# Altium schematic sheet Uc_Ticketing_Master.SchDoc
size A4; Author: Mario Dos Santos; Organization: ETML-ES; Address1: Avenue Recordon 1; Address2: 1004 Lausanne; Address3: Switzerland; Revision: C; SheetNumber: 3; SheetTotal: 6
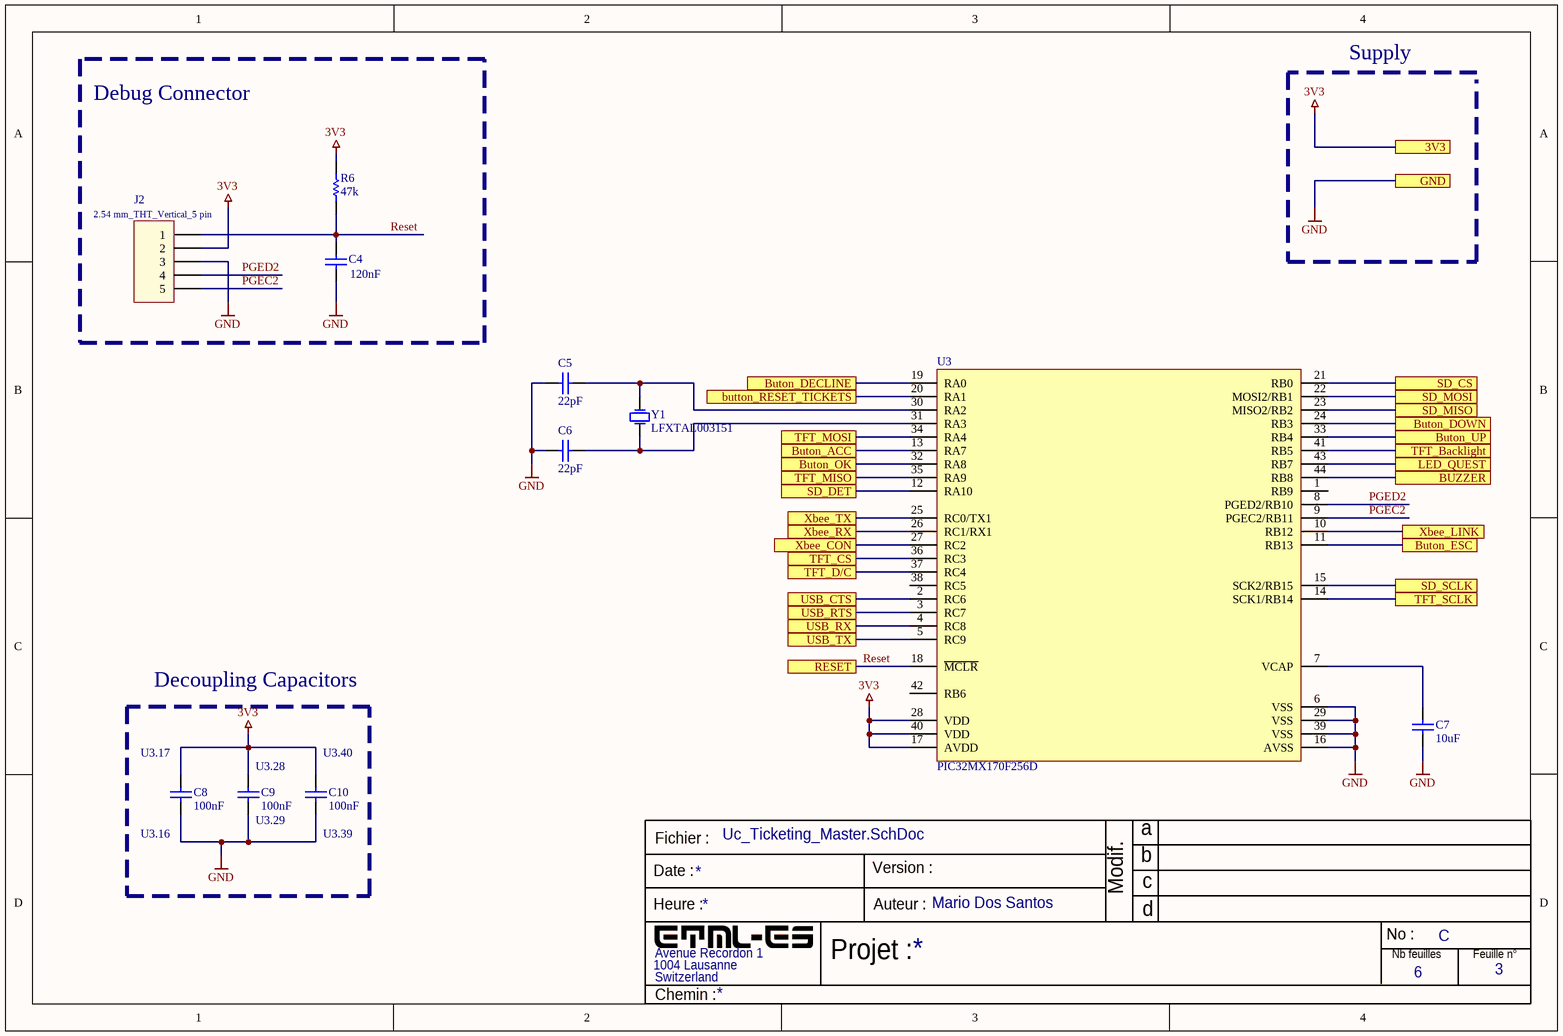
[diagram p0: Uc_Ticketing_Master.SchDoc]

## Parts
C4  120nF  [6-0805_N]
C5  22pF  [6-0805_N]
C6  22pF  [6-0805_N]
C7  10uF  [6-0805_N]
C8  100nF  [6-0805_N]
C9  100nF  [6-0805_N]
C10  100nF  [6-0805_N]
J2  2.54 mm_THT_Vertical_5 pin  [61300511121]
R6  47k  [RESC0805(2012)_L]
U3  PIC32MX170F256D  [MCHP-TQFP-PT44_N]
Y1  LFXTAL003151  [LFXTAL003151REEL]

## Blocks framed on the sheet
Debug Connector: C4 J2 R6
Decoupling Capacitors: C8-C10

## Ports
3V3, Buton_ACC, Buton_DECLINE, Buton_DOWN, Buton_ESC, Buton_OK, Buton_UP, button_RESET_TICKETS, BUZZER, GND, LED_QUEST, RESET, SD_CS, SD_DET, SD_MISO, SD_MOSI, SD_SCLK, TFT_Backlight, TFT_CS, TFT_D/C, TFT_MISO, TFT_MOSI, TFT_SCLK, USB_CTS, USB_RTS, USB_RX, USB_TX, Xbee_CON, Xbee_LINK, Xbee_RX, Xbee_TX

## Nets
3V3: C8.2 C9.2 C10.2 J2.2 R6.1 U3.17(AVDD) U3.28(VDD) U3.40(VDD) ; port 3V3
GND: C4.1 C5.1 C6.1 C7.1 C8.1 C9.1 C10.1 J2.3 U3.6(VSS) U3.16(AVSS) U3.29(VSS) U3.39(VSS) ; port GND
Buton_ACC: U3.13(RA7) ; port Buton_ACC
Buton_DECLINE: U3.19(RA0) ; port Buton_DECLINE
Buton_DOWN: U3.24(RB3) ; port Buton_DOWN
Buton_ESC: U3.11(RB13) ; port Buton_ESC
Buton_OK: U3.32(RA8) ; port Buton_OK
Buton_UP: U3.33(RB4) ; port Buton_UP
button_RESET_TICKETS: U3.20(RA1) ; port button_RESET_TICKETS
BUZZER: U3.44(RB8) ; port BUZZER
LED_QUEST: U3.43(RB7) ; port LED_QUEST
PGEC2: J2.5 U3.9(PGEC2/RB11)
PGED2: J2.4 U3.8(PGED2/RB10)
Reset: C4.2 J2.1 R6.2 U3.18(~{MCLR}) ; port RESET
SD_CS: U3.21(RB0) ; port SD_CS
SD_DET: U3.12(RA10) ; port SD_DET
SD_MISO: U3.23(MISO2/RB2) ; port SD_MISO
SD_MOSI: U3.22(MOSI2/RB1) ; port SD_MOSI
SD_SCLK: U3.15(SCK2/RB15) ; port SD_SCLK
TFT_Backlight: U3.41(RB5) ; port TFT_Backlight
TFT_CS: U3.36(RC3) ; port TFT_CS
TFT_D/C: U3.37(RC4) ; port TFT_D/C
TFT_MISO: U3.35(RA9) ; port TFT_MISO
TFT_MOSI: U3.34(RA4) ; port TFT_MOSI
TFT_SCLK: U3.14(SCK1/RB14) ; port TFT_SCLK
USB_CTS: U3.2(RC6) ; port USB_CTS
USB_RTS: U3.3(RC7) ; port USB_RTS
USB_RX: U3.4(RC8) ; port USB_RX
USB_TX: U3.5(RC9) ; port USB_TX
Xbee_CON: U3.27(RC2) ; port Xbee_CON
Xbee_LINK: U3.10(RB12) ; port Xbee_LINK
Xbee_RX: U3.26(RC1/RX1) ; port Xbee_RX
Xbee_TX: U3.25(RC0/TX1) ; port Xbee_TX
NetC5_2: C5.2 U3.30(RA2) Y1.1
NetC6_2: C6.2 U3.31(RA3) Y1.2
NetC7_2: C7.2 U3.7(VCAP)

Not connected (* = marked no-connect by the designer): U3 1(RB9) 38(RC5) 42(RB6)

## Notes on the sheet
- Supply
- (near C8) U3.17
- (near C9) U3.28
- (near C10) U3.40
- (near C8) U3.16
- (near C9) U3.29
- (near C10) U3.39
- Fichier :
- a
- Date :
- Heure :
- Version :
- Auteur :
- Modif.
- b
- c
- d
- Projet :
- No :
- Nb feuilles
- Feuille n°
- Chemin :

## Library data of the parts
C4 C7-C10 = Cap: Capacitor; Supplier: Digi-Key
  C4: Value: 120nF; Supplier Part Number: 311-4323-1-ND; Supplier unit price: 0.18
  C7: Value: 10uF; Supplier Part Number: 1276-1298-1-ND; Supplier unit price: 0.1
  C8-C10: Value: 100nF; Supplier Part Number: 399-C0805C104M5RAC7800CT-ND; Supplier unit price: 0.1
C5 C6 = CMP-2007-03167-1: VJ0805Y104KNAAT; Supplier: Digi-Key; Supplier Part Number: 399-C0805C220J5GAC7800CT-ND; Supplier unit price: 0.1; Value: 22pF
J2 = 61300511121: Pin Header WR-PHD, pitch 2.54 mm, THT, Vertical, single row, 5 pin; Supplier: Digi-Key; Supplier Part Number: 732-5318-ND; Supplier unit price: 0.25; Value: 2.54 mm_THT_Vertical_5 pin
R6 = CMP-1013-00122-1: 100K 0.125W 5% 0805 (2012 Metric)  SMD; Value: 47k; Supplier: Digi-Key; Supplier Part Number: A130144CT-ND; Supplier unit price: 0.1
U3 = MCHP-PIC32MX2XXFXXXD-TQFP-44: Supplier: Digi-Key; Supplier Part Number: PIC32MX170F256D-I/PT-ND; Supplier unit price: 5.43
Y1 = LFXTAL003151REEL: Crystal or Oscillator; Frequency: 8MHz; Supplier: Farnell; Supplier Part Number: 9713794; Supplier unit price: 0.392; Value: LFXTAL003151